# Altium schematic sheet Sheet1.SchDoc
size A4
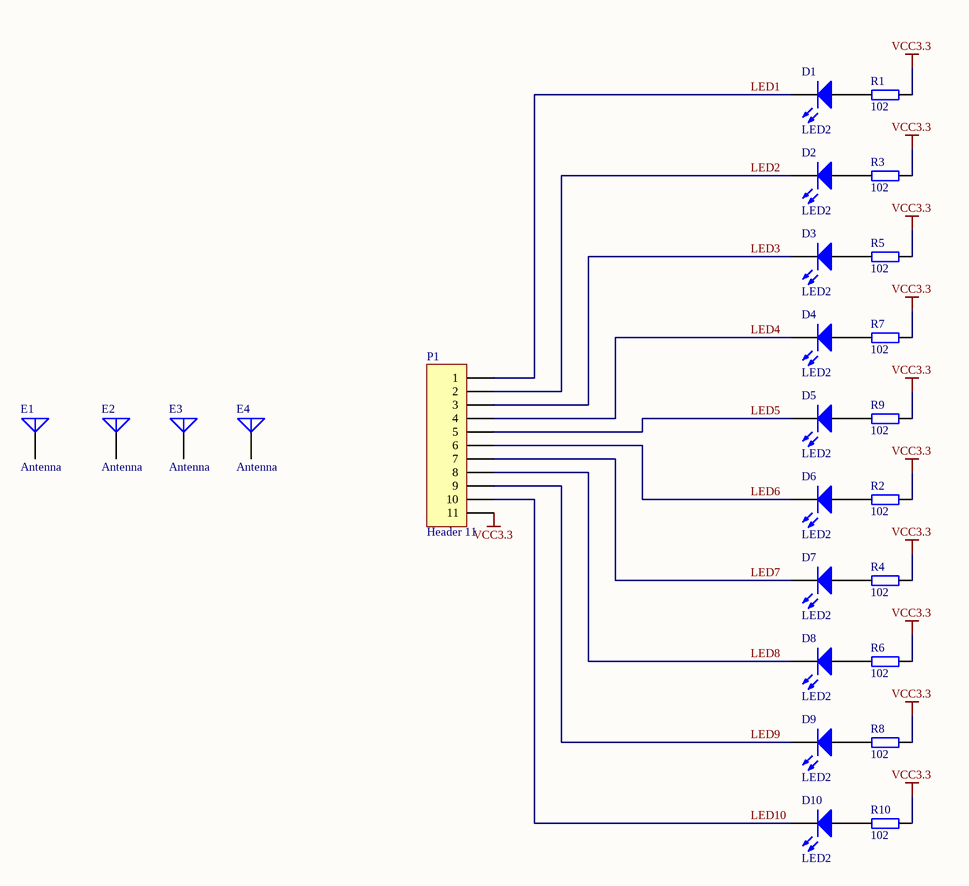
[diagram p0: Sheet1.SchDoc]

## Parts
D1  LED2  [LED1]
D2  LED2  [LED1]
D3  LED2  [LED1]
D4  LED2  [LED1]
D5  LED2  [LED1]
D6  LED2  [LED1]
D7  LED2  [LED1]
D8  LED2  [LED1]
D9  LED2  [LED1]
D10  LED2  [LED1]
E1  Antenna  [定位孔 Φ3.2]
E2  Antenna  [定位孔 Φ3.2]
E3  Antenna  [定位孔 Φ3.2]
E4  Antenna  [定位孔 Φ3.2]
P1  Header 11  [XH11]
R1  102  [0603_R]
R2  102  [0603_R]
R3  102  [0603_R]
R4  102  [0603_R]
R5  102  [0603_R]
R6  102  [0603_R]
R7  102  [0603_R]
R8  102  [0603_R]
R9  102  [0603_R]
R10  102  [0603_R]

## Nets
VCC3.3: P1.11 R1.2 R2.2 R3.2 R4.2 R5.2 R6.2 R7.2 R8.2 R9.2 R10.2
LED1: D1.2(K) P1.1
LED2: D2.2(K) P1.2
LED3: D3.2(K) P1.3
LED4: D4.2(K) P1.4
LED5: D5.2(K) P1.5
LED6: D6.2(K) P1.6
LED7: D7.2(K) P1.7
LED8: D8.2(K) P1.8
LED9: D9.2(K) P1.9
LED10: D10.2(K) P1.10
NetD1_1: D1.1(A) R1.1
NetD2_1: D2.1(A) R3.1
NetD3_1: D3.1(A) R5.1
NetD4_1: D4.1(A) R7.1
NetD5_1: D5.1(A) R9.1
NetD6_1: D6.1(A) R2.1
NetD7_1: D7.1(A) R4.1
NetD8_1: D8.1(A) R6.1
NetD9_1: D9.1(A) R8.1
NetD10_1: D10.1(A) R10.1

Not connected (* = marked no-connect by the designer): E1 1(A); E2 1(A); E3 1(A); E4 1(A)

## Library data of the parts
D1-D10 = LED2: Typical RED, GREEN, YELLOW, AMBER GaAs LED; Published: 8-Jun-2000; LatestRevisionDate: 17-Jul-2002; LatestRevisionNote: Re-released for DXP Platform.; PackageVersion: Feb-2002; PackageReference: 3.2X1.6X1.1; Publisher: Altium Limited; PackageDescription: SM LED; 2 Flat Leads
E1-E4 = Antenna: Generic Antenna; Published: 24-Mar-1999; LatestRevisionDate: 17-Jul-2002; LatestRevisionNote: Re-released for DXP Platform.; PackageReference: PIN1; Publisher: Altium Limited
P1 = Header 11: Header, 11-Pin; LatestRevisionDate: 17-Jul-2002; LatestRevisionNote: Re-released for DXP Platform.; Publisher: Altium Limited
R1-R10 = R_2